# Altium project lm75&eeprom.PrjPcb
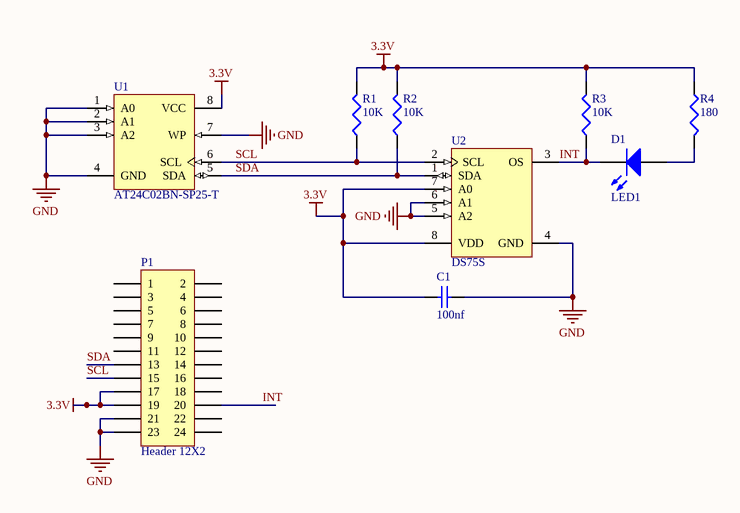
[diagram p0: lm75&eeprom.SchDoc]
1 sheet, 9 parts. Net scope: global (net labels, ports and power ports of the same name join across sheets).
Board file: lm75 eeprom.PcbDoc

## Sheet lm75&eeprom.SchDoc
size A4

### Parts
C1  100nf  [C1206]
D1  LED1  [3.5X2.8X1.9]
P1  Header 12X2  [HDR2X12]
R1  10K  [1206]
R2  10K  [1206]
R3  10K  [1206]
R4  180  [1206]
U1  AT24C02BN-SP25-T  [8S1_N]
U2  DS75S  [MAXM-S8-2_N]

### Nets
3.3V: C1.1 P1.17 P1.19 R1.2 R2.2 R3.2 R4.1 U1.8(VCC) U2.7(A0) U2.8(VDD)
GND: C1.2 P1.21 P1.23 U1.1(A0) U1.2(A1) U1.3(A2) U1.4(GND) U1.7(WP) U2.4(GND) U2.5(A2) U2.6(A1)
INT: D1.2(K) P1.20 R3.1 U2.3(OS)
SCL: P1.15 R1.1 U1.6(SCL) U2.2(SCL)
SDA: P1.13 R2.1 U1.5(SDA) U2.1(SDA)
NetD1_1: D1.1(A) R4.2

Not connected (* = marked no-connect by the designer): P1 1 2 3 4 5 6 7 8 9 10 11 12 14 16 18 22 24

### Library data of the parts
C1 = Cap Semi: Capacitor (Semiconductor SIM Model); Value: 100pF; Published: 8-Jun-2000; LatestRevisionDate: 29-May-2009; LatestRevisionNote: IPC-7351 Footprint Added.; PackageReference: C1206; Publisher: Altium Limited; PackageDescription: Chip Capacitor
D1 = LED3: Typical BLUE SiC LED; Published: 8-Jun-2000; LatestRevisionDate: 17-Dec-2003; LatestRevisionNote: PCB Footprint replaced.; DatasheetVersion: 16-Apr-2002; PackageVersion: 16-Apr-2002; PackageReference: 3.5X2.8X1.9; Publisher: Altium Limited; PackageDescription: SM LED; 2 C-Bend Leads; Body 3.5 x 2.8 x 1.9 mm, inc leads (LxWxH typ)
P1 = Header 12X2: Header, 12-Pin, Dual row; LatestRevisionDate: 17-Jul-2002; LatestRevisionNote: Re-released for DXP Platform.; Publisher: Altium Limited
R1-R4 = Res3: Resistor; Value: 1K; Published: 8-Jun-2000; LatestRevisionDate: 29-May-2009; LatestRevisionNote: IPC-7351 Footprint Added.; PackageReference: J1-0603; Publisher: Altium Limited; PackageDescription: Chip Resistor
U1 = AT24C02BN-SP25-T: 2Kbit (256 x 8), 2-wire Bus Automotive Serial EEPROM with full memory Write Protect, 2.5V, 8-Pin SOIC, Tape & Reel; DatasheetVersion: 8517C,  Jan-2009; PackageVersion: revC, Mar-2005; PackageReference: 8S1; PackageDescription: 8-Lead (0.150" Wide Body), Plastic Gull Wing Small Outline (JEDEC SOIC); Code_JEDEC: MS-012-AA; Code_IPC: SOIC127P600-8; ComponentLink1Description: Manufacturer URL; ComponentLink1URL: http://www.atmel.com/; ComponentLink2Description: Datasheet; ComponentLink2URL: http://www.atmel.com/dyn/resources/prod_documents/doc8517.pdf
U2 = DS75S: Digital Thermometer and Thermostat, 9 to 12 Bits Temperature Resolution, -55 to 125 degC, 8-Pin SOIC (S8-2); Generic Part Number: DS75; Interface: 2-Wire/I2C/SMBus; Multi Droppable: Yes; Parasite Pwr.: No; DatasheetVersion: Rev. 4; PackageVersion: Rev. D, 10/2012; PackageReference: S8-2; PackageDescription: 8-Pin Small-Outline IC, Narrow (0.15in) (S8-2), Body 4.90 x 3.90 mm, Pitch 1.27 mm; Supplier 1: Digi-Key; Supplier Part Number 1: DS75S-ND; Supplier 2: Mouser; Supplier Part Number 2: N/A; Mounting Technology: Surface Mount; Code_JEDEC: MS012; PartNumber: DS75S; ComponentLink1Description: Manufacturer URL; ComponentLink1URL: http://www.maximintegrated.com/; ComponentLink2Description: Datasheet; ComponentLink2URL: http://datasheets.maximintegrated.com/en/ds/DS75.pdf; ComponentLink3Description: Package Specification; ComponentLink3URL: http://pdfserv.maximintegrated.com/package_dwgs/21-0041.PDF